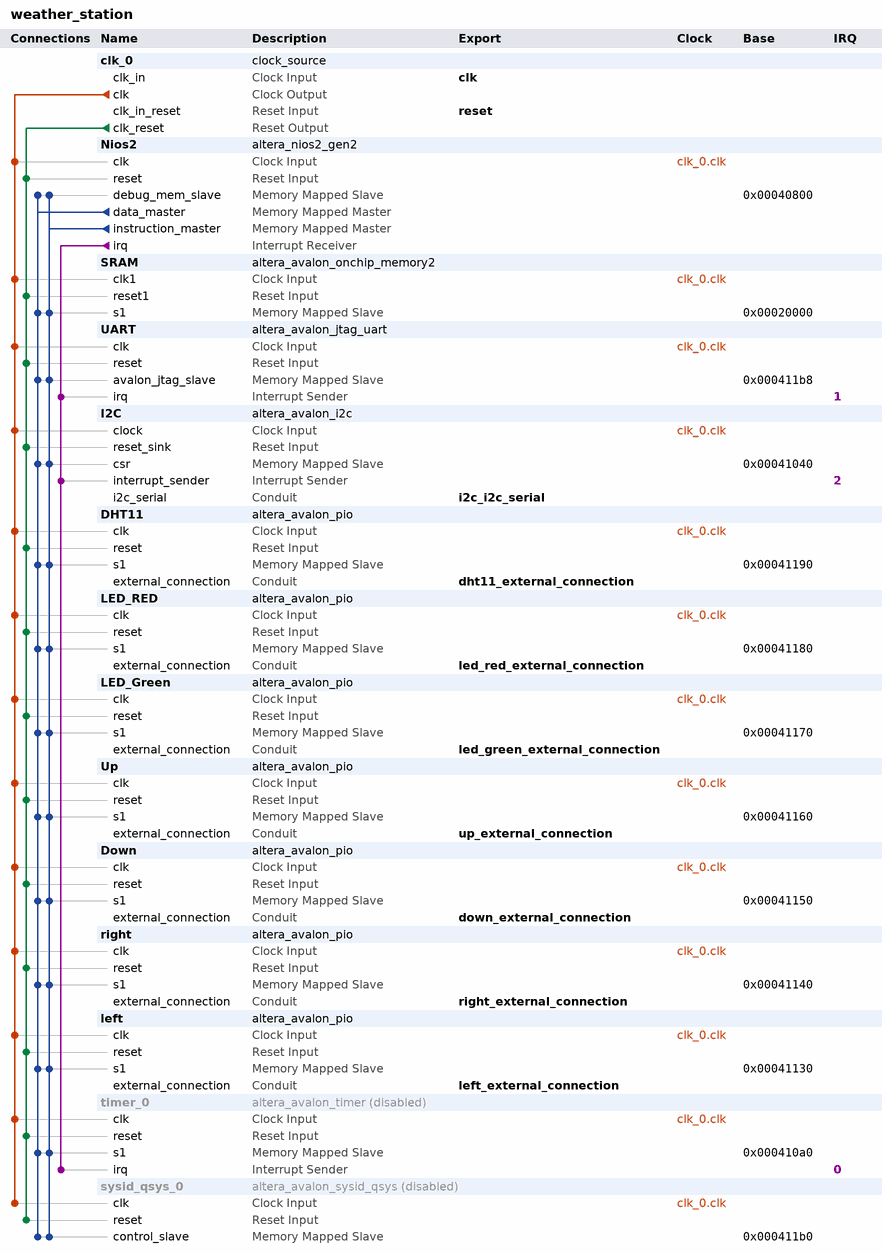
[diagram p0: system contents]
# Platform Designer (Qsys) system weather_station, Cyclone V 5CSEMA4U23C6
# Parameters at their usual value, and those the tool derives, are not listed.
package require -exact qsys 18.1
create_system weather_station
set_project_property DEVICE_FAMILY {Cyclone V}
set_project_property DEVICE 5CSEMA4U23C6

add_instance clk_0 clock_source 18.1
set_instance_parameter_value clk_0 clockFrequency 50000000

add_instance Nios2 altera_nios2_gen2 18.1
set_instance_parameter_value Nios2 dcache_size 2048
set_instance_parameter_value Nios2 exceptionSlave SRAM.s1
set_instance_parameter_value Nios2 icache_size 4096
set_instance_parameter_value Nios2 impl Tiny
set_instance_parameter_value Nios2 resetSlave SRAM.s1

add_instance SRAM altera_avalon_onchip_memory2 18.1
set_instance_parameter_value SRAM dataWidth 32
set_instance_parameter_value SRAM dualPort false
set_instance_parameter_value SRAM initMemContent true
set_instance_parameter_value SRAM initializationFileName onchip_mem.hex
set_instance_parameter_value SRAM memorySize 100000

add_instance UART altera_avalon_jtag_uart 18.1
set_instance_parameter_value UART simInteractiveOptions NO_INTERACTIVE_WINDOWS

add_instance I2C altera_avalon_i2c 18.1
set_instance_parameter_value I2C FIFO_DEPTH 4

add_instance DHT11 altera_avalon_pio 18.1
set_instance_parameter_value DHT11 direction Bidir
set_instance_parameter_value DHT11 width 1

add_instance LED_RED altera_avalon_pio 18.1
set_instance_parameter_value LED_RED direction Output
set_instance_parameter_value LED_RED width 1

add_instance LED_Green altera_avalon_pio 18.1
set_instance_parameter_value LED_Green direction Output
set_instance_parameter_value LED_Green width 1

add_instance Up altera_avalon_pio 18.1
set_instance_parameter_value Up direction Input
set_instance_parameter_value Up width 1

add_instance Down altera_avalon_pio 18.1
set_instance_parameter_value Down direction Input
set_instance_parameter_value Down width 1

add_instance right altera_avalon_pio 18.1
set_instance_parameter_value right direction Input
set_instance_parameter_value right width 1

add_instance left altera_avalon_pio 18.1
set_instance_parameter_value left direction Input
set_instance_parameter_value left width 1

add_instance timer_0 altera_avalon_timer 18.1
set_instance_property timer_0 ENABLED false
set_instance_parameter_value timer_0 period 1
set_instance_parameter_value timer_0 periodUnits USEC

add_instance sysid_qsys_0 altera_avalon_sysid_qsys 18.1
set_instance_property sysid_qsys_0 ENABLED false
set_instance_parameter_value sysid_qsys_0 id 0

# connections
add_connection clk_0.clk DHT11.clk clock
add_connection clk_0.clk Down.clk clock
add_connection clk_0.clk I2C.clock clock
add_connection clk_0.clk LED_Green.clk clock
add_connection clk_0.clk LED_RED.clk clock
add_connection clk_0.clk left.clk clock
add_connection clk_0.clk Nios2.clk clock
add_connection clk_0.clk right.clk clock
add_connection clk_0.clk SRAM.clk1 clock
add_connection clk_0.clk sysid_qsys_0.clk clock
add_connection clk_0.clk timer_0.clk clock
add_connection clk_0.clk UART.clk clock
add_connection clk_0.clk Up.clk clock
add_connection clk_0.clk_reset DHT11.reset reset
add_connection clk_0.clk_reset Down.reset reset
add_connection clk_0.clk_reset I2C.reset_sink reset
add_connection clk_0.clk_reset LED_Green.reset reset
add_connection clk_0.clk_reset LED_RED.reset reset
add_connection clk_0.clk_reset left.reset reset
add_connection clk_0.clk_reset Nios2.reset reset
add_connection clk_0.clk_reset right.reset reset
add_connection clk_0.clk_reset SRAM.reset1 reset
add_connection clk_0.clk_reset sysid_qsys_0.reset reset
add_connection clk_0.clk_reset timer_0.reset reset
add_connection clk_0.clk_reset UART.reset reset
add_connection clk_0.clk_reset Up.reset reset
add_connection Nios2.data_master DHT11.s1 avalon
set_connection_parameter_value Nios2.data_master/DHT11.s1 baseAddress 0x00041190
add_connection Nios2.data_master Down.s1 avalon
set_connection_parameter_value Nios2.data_master/Down.s1 baseAddress 0x00041150
add_connection Nios2.data_master I2C.csr avalon
set_connection_parameter_value Nios2.data_master/I2C.csr baseAddress 0x00041040
add_connection Nios2.data_master LED_Green.s1 avalon
set_connection_parameter_value Nios2.data_master/LED_Green.s1 baseAddress 0x00041170
add_connection Nios2.data_master LED_RED.s1 avalon
set_connection_parameter_value Nios2.data_master/LED_RED.s1 baseAddress 0x00041180
add_connection Nios2.data_master left.s1 avalon
set_connection_parameter_value Nios2.data_master/left.s1 baseAddress 0x00041130
add_connection Nios2.data_master Nios2.debug_mem_slave avalon
set_connection_parameter_value Nios2.data_master/Nios2.debug_mem_slave baseAddress 0x00040800
add_connection Nios2.data_master right.s1 avalon
set_connection_parameter_value Nios2.data_master/right.s1 baseAddress 0x00041140
add_connection Nios2.data_master SRAM.s1 avalon
set_connection_parameter_value Nios2.data_master/SRAM.s1 baseAddress 0x00020000
add_connection Nios2.data_master sysid_qsys_0.control_slave avalon
set_connection_parameter_value Nios2.data_master/sysid_qsys_0.control_slave baseAddress 0x000411b0
add_connection Nios2.data_master timer_0.s1 avalon
set_connection_parameter_value Nios2.data_master/timer_0.s1 baseAddress 0x000410a0
add_connection Nios2.data_master UART.avalon_jtag_slave avalon
set_connection_parameter_value Nios2.data_master/UART.avalon_jtag_slave baseAddress 0x000411b8
add_connection Nios2.data_master Up.s1 avalon
set_connection_parameter_value Nios2.data_master/Up.s1 baseAddress 0x00041160
add_connection Nios2.instruction_master DHT11.s1 avalon
set_connection_parameter_value Nios2.instruction_master/DHT11.s1 baseAddress 0x00041190
add_connection Nios2.instruction_master Down.s1 avalon
set_connection_parameter_value Nios2.instruction_master/Down.s1 baseAddress 0x00041150
add_connection Nios2.instruction_master I2C.csr avalon
set_connection_parameter_value Nios2.instruction_master/I2C.csr baseAddress 0x00041040
add_connection Nios2.instruction_master LED_Green.s1 avalon
set_connection_parameter_value Nios2.instruction_master/LED_Green.s1 baseAddress 0x00041170
add_connection Nios2.instruction_master LED_RED.s1 avalon
set_connection_parameter_value Nios2.instruction_master/LED_RED.s1 baseAddress 0x00041180
add_connection Nios2.instruction_master left.s1 avalon
set_connection_parameter_value Nios2.instruction_master/left.s1 baseAddress 0x00041130
add_connection Nios2.instruction_master Nios2.debug_mem_slave avalon
set_connection_parameter_value Nios2.instruction_master/Nios2.debug_mem_slave baseAddress 0x00040800
add_connection Nios2.instruction_master right.s1 avalon
set_connection_parameter_value Nios2.instruction_master/right.s1 baseAddress 0x00041140
add_connection Nios2.instruction_master SRAM.s1 avalon
set_connection_parameter_value Nios2.instruction_master/SRAM.s1 baseAddress 0x00020000
add_connection Nios2.instruction_master sysid_qsys_0.control_slave avalon
set_connection_parameter_value Nios2.instruction_master/sysid_qsys_0.control_slave baseAddress 0x000411b0
add_connection Nios2.instruction_master timer_0.s1 avalon
set_connection_parameter_value Nios2.instruction_master/timer_0.s1 baseAddress 0x000410a0
add_connection Nios2.instruction_master UART.avalon_jtag_slave avalon
set_connection_parameter_value Nios2.instruction_master/UART.avalon_jtag_slave baseAddress 0x000411b8
add_connection Nios2.instruction_master Up.s1 avalon
set_connection_parameter_value Nios2.instruction_master/Up.s1 baseAddress 0x00041160
add_connection Nios2.irq I2C.interrupt_sender interrupt
set_connection_parameter_value Nios2.irq/I2C.interrupt_sender irqNumber 2
add_connection Nios2.irq timer_0.irq interrupt
set_connection_parameter_value Nios2.irq/timer_0.irq irqNumber 0
add_connection Nios2.irq UART.irq interrupt
set_connection_parameter_value Nios2.irq/UART.irq irqNumber 1

# exported interfaces
add_interface clk clock sink
set_interface_property clk EXPORT_OF clk_0.clk_in
add_interface dht11_external_connection conduit end
set_interface_property dht11_external_connection EXPORT_OF DHT11.external_connection
add_interface down_external_connection conduit end
set_interface_property down_external_connection EXPORT_OF Down.external_connection
add_interface i2c_i2c_serial conduit end
set_interface_property i2c_i2c_serial EXPORT_OF I2C.i2c_serial
add_interface led_green_external_connection conduit end
set_interface_property led_green_external_connection EXPORT_OF LED_Green.external_connection
add_interface led_red_external_connection conduit end
set_interface_property led_red_external_connection EXPORT_OF LED_RED.external_connection
add_interface left_external_connection conduit end
set_interface_property left_external_connection EXPORT_OF left.external_connection
add_interface reset reset sink
set_interface_property reset EXPORT_OF clk_0.clk_in_reset
add_interface right_external_connection conduit end
set_interface_property right_external_connection EXPORT_OF right.external_connection
add_interface up_external_connection conduit end
set_interface_property up_external_connection EXPORT_OF Up.external_connection

set_interconnect_requirement {$system} qsys_mm.clockCrossingAdapter HANDSHAKE
set_interconnect_requirement {$system} qsys_mm.enableEccProtection FALSE
set_interconnect_requirement {$system} qsys_mm.insertDefaultSlave FALSE
set_interconnect_requirement {$system} qsys_mm.maxAdditionalLatency 1

save_system weather_station.qsys
